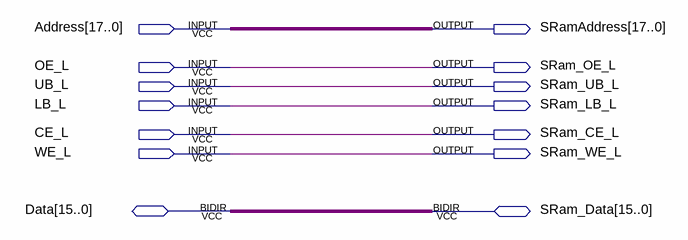
[diagram p0: schematic sheet]
// Quartus schematic DE1OnBoardRam.bdf as structural Verilog: 0 symbols, 14 pins
module DE1OnBoardRam (
  input  [17:0] Address,
  input  OE_L,
  input  UB_L,
  input  LB_L,
  input  CE_L,
  input  WE_L,
  inout  [15:0] Data,
  inout  [15:0] SRam_Data,
  output [17:0] SRamAddress,
  output SRam_OE_L,
  output SRam_UB_L,
  output SRam_LB_L,
  output SRam_CE_L,
  output SRam_WE_L
);


  assign SRam_CE_L = CE_L;
  assign SRam_Data = Data;
  assign SRam_LB_L = LB_L;
  assign SRam_OE_L = OE_L;
  assign SRam_UB_L = UB_L;
  assign SRam_WE_L = WE_L;
  assign SRamAddress = Address;
endmodule
